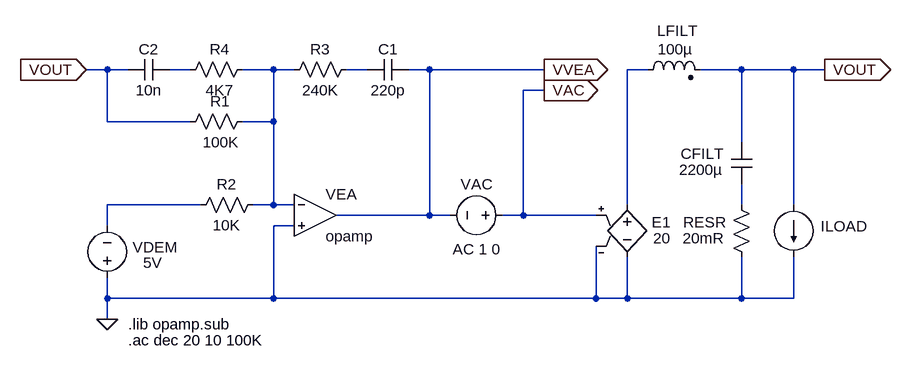
[diagram p0: schematic voltmodelinb.asc]
voltmodelinb.asc, the LTspice schematic file:
Version 4
SHEET 1 880 1136
WIRE -592 160 -624 160
WIRE -592 240 -592 160
WIRE -592 400 -592 368
WIRE -592 512 -592 480
WIRE -592 544 -592 512
WIRE -560 160 -592 160
WIRE -464 160 -496 160
WIRE -464 240 -592 240
WIRE -448 368 -592 368
WIRE -336 160 -384 160
WIRE -336 240 -384 240
WIRE -336 240 -336 160
WIRE -336 368 -368 368
WIRE -336 368 -336 240
WIRE -336 512 -592 512
WIRE -336 512 -336 400
WIRE -304 160 -336 160
WIRE -304 368 -336 368
WIRE -304 400 -336 400
WIRE -192 160 -224 160
WIRE -96 160 -128 160
WIRE -96 384 -240 384
WIRE -96 384 -96 160
WIRE -64 384 -96 384
WIRE 48 384 16 384
WIRE 48 384 48 192
WIRE 80 160 -96 160
WIRE 80 192 48 192
WIRE 160 384 48 384
WIRE 160 512 -336 512
WIRE 160 512 160 432
WIRE 208 368 208 160
WIRE 208 512 160 512
WIRE 208 512 208 448
WIRE 240 160 208 160
WIRE 384 160 320 160
WIRE 384 272 384 160
WIRE 384 368 384 336
WIRE 384 512 208 512
WIRE 384 512 384 448
WIRE 464 160 384 160
WIRE 464 368 464 160
WIRE 464 512 384 512
WIRE 464 512 464 448
WIRE 512 160 464 160
FLAG -624 160 VOUT
IOPIN -624 160 In
FLAG -592 544 0
FLAG 80 160 VVEA
IOPIN 80 160 Out
FLAG 512 160 VOUT
IOPIN 512 160 Out
FLAG 80 192 VAC
IOPIN 80 192 Out
SYMBOL ind2 224 176 R270
WINDOW 0 60 62 VTop 0
WINDOW 3 63 58 VBottom 0
SYMATTR InstName LFILT
SYMATTR Value 100µ
SYMATTR Type ind
SYMBOL Opamps\\opamp -272 320 R0
SYMATTR InstName VEA
SYMATTR SpiceLine2 GBW=400Meg
SYMBOL res -208 144 R90
WINDOW 0 0 56 VBottom 0
WINDOW 3 32 56 VTop 0
SYMATTR InstName R3
SYMATTR Value 240K
SYMBOL cap -128 144 R90
WINDOW 0 0 32 VBottom 0
WINDOW 3 32 32 VTop 0
SYMATTR InstName C1
SYMATTR Value 220p
SYMBOL res -368 224 R90
WINDOW 0 0 50 VBottom 0
WINDOW 3 32 49 VTop 0
SYMATTR InstName R1
SYMATTR Value 100K
SYMBOL res -352 352 R90
WINDOW 0 0 56 VBottom 0
WINDOW 3 32 56 VTop 0
SYMATTR InstName R2
SYMATTR Value 10K
SYMBOL voltage -592 496 R180
WINDOW 0 -108 63 Left 0
WINDOW 3 -85 39 Left 0
WINDOW 123 0 0 Left 0
WINDOW 39 0 0 Left 0
SYMATTR InstName VDEM
SYMATTR Value 5V
SYMBOL cap 368 272 R0
WINDOW 0 -78 17 Left 0
WINDOW 3 -80 42 Left 0
SYMATTR InstName CFILT
SYMATTR Value 2200µ
SYMATTR SpiceLine IC=50V
SYMBOL res 368 352 R0
WINDOW 0 -74 43 Left 0
WINDOW 3 -75 67 Left 0
SYMATTR InstName RESR
SYMATTR Value 20mR
SYMBOL load2 464 368 R0
WINDOW 0 42 33 Left 0
WINDOW 3 42 61 Invisible 0
WINDOW 123 0 0 Left 0
WINDOW 39 0 0 Left 0
SYMATTR InstName ILOAD
SYMATTR Value PULSE(5 15 0 10n 10n 100u 200u)
SYMBOL e 208 352 R0
WINDOW 0 38 43 Left 0
WINDOW 3 40 67 Left 0
SYMATTR InstName E1
SYMATTR Value 20
SYMBOL voltage 32 384 R90
WINDOW 0 -32 56 VBottom 0
WINDOW 3 32 56 VTop 0
WINDOW 123 37 56 VTop 0
WINDOW 39 0 0 Left 0
SYMATTR InstName VAC
SYMATTR Value ""
SYMATTR Value2 AC 1 0
SYMBOL cap -496 144 R90
WINDOW 0 0 32 VBottom 0
WINDOW 3 32 32 VTop 0
SYMATTR InstName C2
SYMATTR Value 10n
SYMBOL res -368 144 R90
WINDOW 0 0 51 VBottom 0
WINDOW 3 32 51 VTop 0
SYMATTR InstName R4
SYMATTR Value 4K7
TEXT -560 552 Left 0 !.lib opamp.sub
TEXT -560 576 Left 0 !.ac dec 20 10 100K

The netlist it stands for:
* voltmodelinb.asc
LFILT N005 VOUT 100µ
XVEA N003 0 VVEA opamp Aol=100K GBW=400Meg  ; pins invin noninvin out
R3 N004 N003 240K
C1 VVEA N004 220p
R1 N003 VOUT 100K
R2 N003 N001 10K
VDEM 0 N001 5V
CFILT VOUT N006 2200µ IC=50V
RESR N006 0 20mR
ILOAD VOUT 0 PULSE(5 15 0 10n 10n 100u 200u)
E1 N005 0 VAC 0 20
VAC VAC VVEA AC 1 0
C2 N002 VOUT 10n
R4 N003 N002 4K7
.lib opamp.sub
.ac dec 20 10 100K
.backanno
.end